# EAGLE design Jalebi_Bai0.1 (EAGLE 7.5.0)
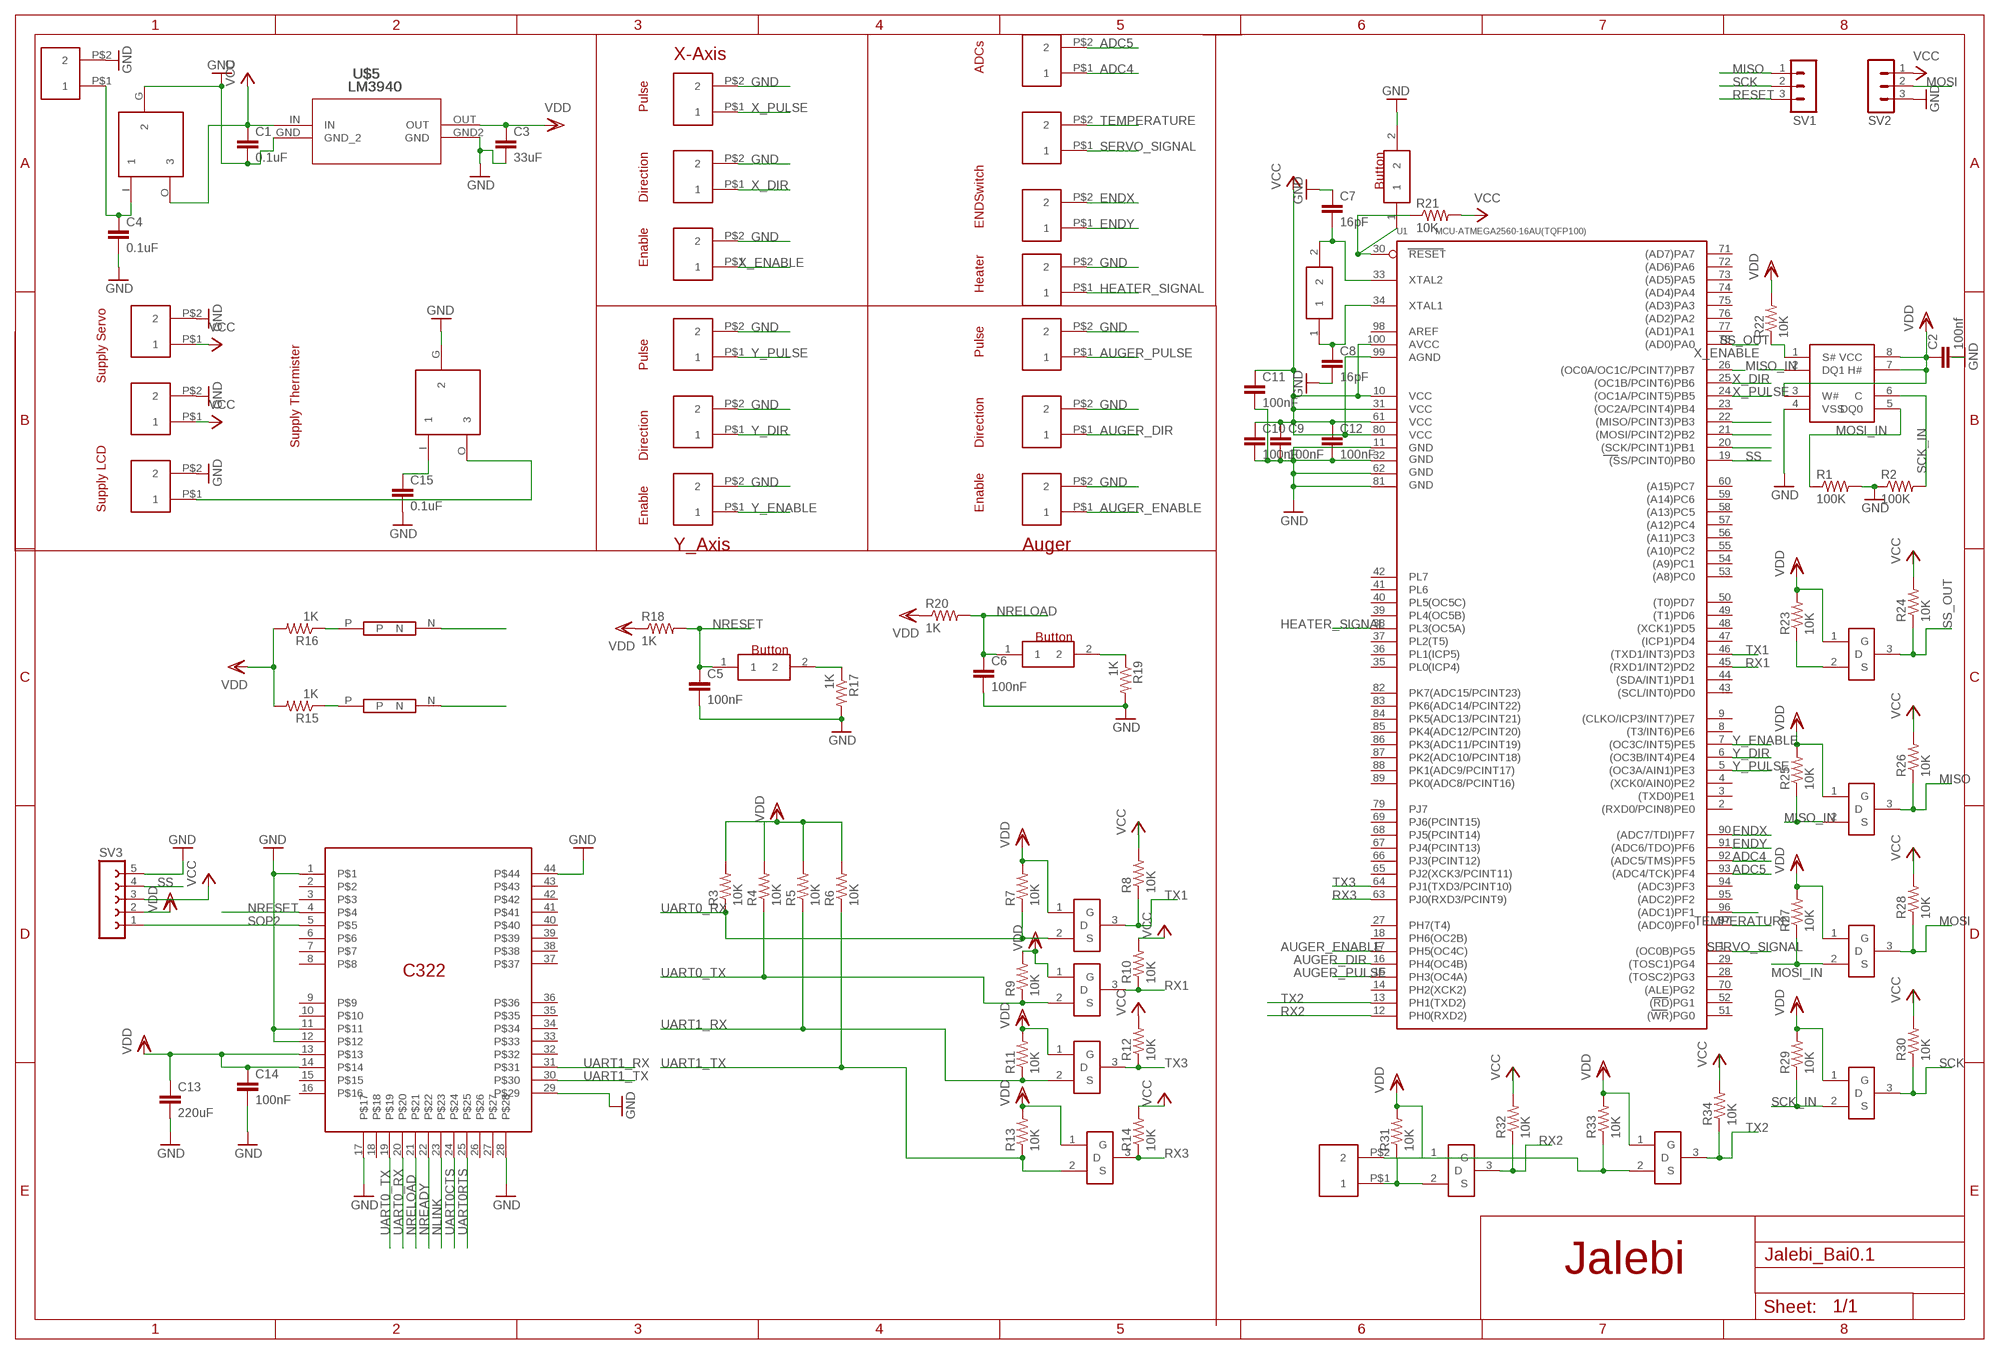
[diagram p0: schematic, sheet 1]

## Parts
C1  0.1uF  C-EUC0805  [C0805]
C2  100nf  C-EUC0805  [C0805]
C3  33uF  C-EUC0805  [C0805]
C4  0.1uF  C-EUC0805  [C0805]
C5  100nF  C-EUC0805  [C0805]
C6  100nF  C-EUC0805  [C0805]
C7  16pF  C-EUC0805  [C0805]
C8  16pF  C-EUC0805  [C0805]
C9  100nF  C-EUC0805  [C0805]
C10  100nF  C-EUC0805  [C0805]
C11  100nF  C-EUC0805  [C0805]
C12  100nF  C-EUC0805  [C0805]
C13  220uF  C-EUC0805  [C0805]
C14  100nF  C-EUC0805  [C0805]
C15  0.1uF  C-EUC0805  [C0805]
R1  100K  R-US_R0805  [R0805]
R2  100K  R-US_R0805  [R0805]
R3  10K  R-US_R0805  [R0805]
R4  10K  R-US_R0805  [R0805]
R5  10K  R-US_R0805  [R0805]
R6  10K  R-US_R0805  [R0805]
R7  10K  R-US_R0805  [R0805]
R8  10K  R-US_R0805  [R0805]
R9  10K  R-US_R0805  [R0805]
R10  10K  R-US_R0805  [R0805]
R11  10K  R-US_R0805  [R0805]
R12  10K  R-US_R0805  [R0805]
R13  10K  R-US_R0805  [R0805]
R14  10K  R-US_R0805  [R0805]
R15  1K  R-US_R0805  [R0805]
R16  1K  R-US_R0805  [R0805]
R17  1K  R-US_R0805  [R0805]
R18  1K  R-US_R0805  [R0805]
R19  1K  R-US_R0805  [R0805]
R20  1K  R-US_R0805  [R0805]
R21  10K  R-US_R0805  [R0805]
R22  10K  R-US_R0805  [R0805]
R23  10K  R-US_R0805  [R0805]
R24  10K  R-US_R0805  [R0805]
R25  10K  R-US_R0805  [R0805]
R26  10K  R-US_R0805  [R0805]
R27  10K  R-US_R0805  [R0805]
R28  10K  R-US_R0805  [R0805]
R29  10K  R-US_R0805  [R0805]
R30  10K  R-US_R0805  [R0805]
R31  10K  R-US_R0805  [R0805]
R32  10K  R-US_R0805  [R0805]
R33  10K  R-US_R0805  [R0805]
R34  10K  R-US_R0805  [R0805]
SUPPLY_LCD  TERMINALBLOCK2PIN  [TERMINALBLOCK2]
SUPPLY_SERVO  TERMINALBLOCK2PIN  [TERMINALBLOCK2]
SUPPLY_THERMISTER  TERMINALBLOCK2PIN  [TERMINALBLOCK2]
SV1  MA03-1  [MA03-1]
SV2  MA03-1  [MA03-1]
SV3  FE05-1  [FE05-1]
U1  MCU-ATMEGA2560-16AU(TQFP100)  [TQFP100-0.5-14X14MM]
U$1  C322STD  [C322]
U$2  7805  [7805]
U$3  TERMINALBLOCK2PIN  [TERMINALBLOCK2]
U$4  FLASHM25PX80  [SO08]
U$5  LM3940  [MP04A]
U$6  BSS138  [SOT23]
U$7  BSS138  [SOT23]
U$8  BSS138  [SOT23]
U$9  BSS138  [SOT23]
U$10  LED(805)  [LED(805)]
U$11  LED(805)  [LED(805)]
U$12  BUTTON  [BUTTON]
U$13  BUTTON  [BUTTON]
U$14  TERMINALBLOCK2PIN  [TERMINALBLOCK2]
U$15  CRYSTAL  [CRYSTAL]
U$16  BUTTON  [BUTTON]
U$17  BSS138  [SOT23]
U$18  BSS138  [SOT23]
U$19  BSS138  [SOT23]
U$20  BSS138  [SOT23]
U$21  BSS138  [SOT23]
U$22  BSS138  [SOT23]
U$23  TERMINALBLOCK2PIN  [TERMINALBLOCK2]
U$24  TERMINALBLOCK2PIN  [TERMINALBLOCK2]
U$25  7805  [7805]
U$26  TERMINALBLOCK2PIN  [TERMINALBLOCK2]
U$27  TERMINALBLOCK2PIN  [TERMINALBLOCK2]
U$28  TERMINALBLOCK2PIN  [TERMINALBLOCK2]
U$29  TERMINALBLOCK2PIN  [TERMINALBLOCK2]
U$30  TERMINALBLOCK2PIN  [TERMINALBLOCK2]
U$31  TERMINALBLOCK2PIN  [TERMINALBLOCK2]
U$32  TERMINALBLOCK2PIN  [TERMINALBLOCK2]
U$34  TERMINALBLOCK2PIN  [TERMINALBLOCK2]
U$35  TERMINALBLOCK2PIN  [TERMINALBLOCK2]
U$36  TERMINALBLOCK2PIN  [TERMINALBLOCK2]
U$37  TERMINALBLOCK2PIN  [TERMINALBLOCK2]

## Nets
ADC4: U1.92((ADC5/TMS)PF5) U$24.P$1
ADC5: U1.93((ADC4/TCK)PF4) U$24.P$2
AUGER_DIR: U1.16(PH4(OC4B)) U$36.P$1
AUGER_ENABLE: U1.17(PH5(OC4C)) U$37.P$1
AUGER_PULSE: U1.15(PH3(OC4A)) U$35.P$1
ENDX: U1.90((ADC7/TDI)PF7) U$23.P$2
ENDY: U1.91((ADC6/TDO)PF6) U$23.P$1
GND: C1.2 C2.2 C3.2 C4.2 C5.2 C6.2 C7.1 C8.2 C9.2 C10.2 C11.2 C12.2 C13.2 C14.2 C15.2 R1.2 R2.1 R17.2 R19.2 SUPPLY_LCD.P$2 SUPPLY_SERVO.P$2 SUPPLY_THERMISTER.P$2 SV2.3 SV3.5 U1.11(GND) U1.32(GND1) U1.62(GND2) U1.81(GND3) U$1.1 U$1.11 U$1.12 U$1.17 U$1.28 U$1.29 U$1.44 U$2.G U$3.P$2 U$4.4(VSS) U$5.GND2(GND) U$5.GND(GND_2) U$16.2 U$25.G U$26.P$2 U$27.P$2 U$28.P$2 U$29.P$2 U$30.P$2 U$31.P$2 U$34.P$2 U$35.P$2 U$36.P$2 U$37.P$2
HEATER_SIGNAL: U1.38(PL3(OC5A)) U$34.P$1
MISO: R26.1 SV1.1 U1.22((MISO/PCINT3)PB3) U$18.3(D)
MISO_IN: R25.1 U$4.2(DQ1) U$18.2(S)
MOSI: R28.1 SV2.2 U1.21((MOSI/PCINT2)PB2) U$19.3(D)
MOSI_IN: R1.1 R27.1 U$4.5(DQ0) U$19.2(S)
N$1: U1.96((ADC1)PF1)
N$3: SUPPLY_LCD.P$1 U$25.O
N$5: C4.1 C15.1 U$2.I U$3.P$1 U$25.I
N$9: R15.1 U$11.P
N$10: C7.2 U1.33(XTAL2) U$15.2
N$11: R16.1 U$10.P
N$12: C8.1 U1.34(XTAL1) U$15.1
N$15: R17.1 U$12.2
N$17: R19.1 U$13.2
NLINK: U$1.23 U$10.N
NREADY: U$1.22 U$11.N
NRELOAD: C6.1 R20.2 U$1.21 U$13.1
NRESET: C5.1 R18.2 U$1.4 U$12.1
RESET: R21.1 SV1.3 U1.30(RESET) U$16.1
RX1: R10.1 U1.45((RXD1/INT2)PD2) U$7.3(D)
RX2: R32.1 U1.12(PH0(RXD2)) U$21.3(D)
RX3: R14.1 U1.63(PJ0(RXD3/PCINT9)) U$9.3(D)
RX_IN: R31.1 U$14.P$1 U$21.2(S)
SCK: R30.1 SV1.2 U1.20((SCK/PCINT1)PB1) U$20.3(D)
SCK_IN: R2.2 R29.1 U$4.6(C) U$20.2(S)
SERVO_SIGNAL: U1.1((OC0B)PG5) U$32.P$1
SOP2: SV3.1 U$1.5
SS: SV3.4 U1.19((SS/PCINT0)PB0)
SS_IN: R22.1 R23.1 U$4.1(S#) U$17.2(S)
SS_OUT: R24.1 U1.78((AD0)PA0) U$17.3(D)
TEMPERATURE: U1.97((ADC0)PF0) U$32.P$2
TX1: R8.1 U1.46((TXD1/INT3)PD3) U$6.3(D)
TX2: R34.1 U1.13(PH1(TXD2)) U$22.3(D)
TX3: R12.1 U1.64(PJ1(TXD3/PCINT10)) U$8.3(D)
TX_IN: R33.1 U$14.P$2 U$22.2(S)
UART0_RX: R3.1 R7.1 U$1.20 U$6.2(S)
UART0_TX: R4.1 R9.1 U$1.19 U$7.2(S)
UART0CTS: U$1.24
UART0RTS: U$1.25
UART1_RX: R5.1 R11.1 U$1.31 U$8.2(S)
UART1_TX: R6.1 R13.1 U$1.30 U$9.2(S)
VCC: C1.1 C9.1 C10.1 C11.1 C12.1 R8.2 R10.2 R12.2 R14.2 R21.2 R24.2 R26.2 R28.2 R30.2 R32.2 R34.2 SUPPLY_SERVO.P$1 SUPPLY_THERMISTER.P$1 SV2.1 SV3.3 U1.10(VCC) U1.31(VCC1) U1.61(VCC2) U1.80(VCC3) U1.99(AGND) U1.100(AVCC) U$2.O U$5.IN
VDD: C2.1 C3.1 C13.1 C14.1 R3.2 R4.2 R5.2 R6.2 R7.2 R9.2 R11.2 R13.2 R15.2 R16.2 R18.1 R20.1 R22.2 R23.2 R25.2 R27.2 R29.2 R31.2 R33.2 SV3.2 U$1.13 U$1.14 U$4.3(W#) U$4.7(H#) U$4.8(VCC) U$5.OUT U$6.1(G) U$7.1(G) U$8.1(G) U$9.1(G) U$17.1(G) U$18.1(G) U$19.1(G) U$20.1(G) U$21.1(G) U$22.1(G)
X_DIR: U1.25((OC1B/PCINT6)PB6) U$27.P$1
X_ENABLE: U1.26((OC0A/OC1C/PCINT7)PB7) U$28.P$1
X_PULSE: U1.24((OC1A/PCINT5)PB5) U$26.P$1
Y_DIR: U1.6((OC3B/INT4)PE4) U$30.P$1
Y_ENABLE: U1.7((OC3C/INT5)PE5) U$31.P$1
Y_PULSE: U1.5((OC3A/AIN1)PE3) U$29.P$1
Unconnected: U1.2((RXD0/PCIN8)PE0) U1.3((TXD0)PE1) U1.4((XCK0/AIN0)PE2) U1.8((T3/INT6)PE6) U1.9((CLKO/ICP3/INT7)PE7) U1.14(PH2(XCK2)) U1.18(PH6(OC2B)) U1.23((OC2A/PCINT4)PB4) U1.27(PH7(T4)) U1.28((TOSC2)PG3) U1.29((TOSC1)PG4) U1.35(PL0(ICP4)) U1.36(PL1(ICP5)) U1.37(PL2(T5)) U1.39(PL4(OC5B)) U1.40(PL5(OC5C)) U1.41(PL6) U1.42(PL7) U1.43((SCL/INT0)PD0) U1.44((SDA/INT1)PD1) U1.47((ICP1)PD4) U1.48((XCK1)PD5) U1.49((T1)PD6) U1.50((T0)PD7) U1.51((WR)PG0) U1.52((RD)PG1) U1.53((A8)PC0) U1.54((A9)PC1) U1.55((A10)PC2) U1.56((A11)PC3) U1.57((A12)PC4) U1.58((A13)PC5) U1.59((A14)PC6) U1.60((A15)PC7) U1.65(PJ2(XCK3/PCINT11)) U1.66(PJ3(PCINT12)) U1.67(PJ4(PCINT13)) U1.68(PJ5(PCINT14)) U1.69(PJ6(PCINT15)) U1.70((ALE)PG2) U1.71((AD7)PA7) U1.72((AD6)PA6) U1.73((AD5)PA5) U1.74((AD4)PA4) U1.75((AD3)PA3) U1.76((AD2)PA2) U1.77((AD1)PA1) U1.79(PJ7) U1.82(PK7(ADC15/PCINT23)) U1.83(PK6(ADC14/PCINT22)) U1.84(PK5(ADC13/PCINT21)) U1.85(PK4(ADC12/PCINT20)) U1.86(PK3(ADC11/PCINT19)) U1.87(PK2(ADC10/PCINT18)) U1.88(PK1(ADC9/PCINT17)) U1.89(PK0(ADC8/PCINT16)) U1.94((ADC3)PF3) U1.95((ADC2)PF2) U1.98(AREF) U$1.2 U$1.3 U$1.6 U$1.7 U$1.8 U$1.9 U$1.10 U$1.15 U$1.16 U$1.18 U$1.26 U$1.27 U$1.32 U$1.33 U$1.34 U$1.35 U$1.36 U$1.37 U$1.38 U$1.39 U$1.40 U$1.41 U$1.42 U$1.43

## Notes on the sheet
- X-Axis
- ADCs
- Pulse
- Direction
- ENDSwitch
- Enable
- Heater
- Pulse
- Pulse
- Supply Servo
- Supply Thermister | Direction
- Direction
- Supply LCD | Enable
- Enable
- Y_Axis | Auger
- Jalebi

## Library data of the parts
C1-C15 = resistor:C-EU: CAPACITOR, European symbol
R1-R34 = resistor:R-US_: RESISTOR, American symbol
SUPPLY_LCD SUPPLY_SERVO SUPPLY_THERMISTER U$3 U$14 U$23 U$24 U$26-U$32 U$34-U$37 = utilities:TERMINALBLOCK
SV1 SV2 = con-lstb:MA03-1: PIN HEADER; OC_FARNELL: unknown; OC_NEWARK: unknown
SV3 = con-lsta:FE05-1: FEMALE HEADER; OC_FARNELL: unknown; OC_NEWARK: unknown
U1 = MCU-ATMEGA2560-16AU_TQFP100_:MCU-ATMEGA2560-16AU(TQFP100): 310010006; AVAILABILITY: Good; DESCRIPTION: ATmega Series 16 MHz 256 KB Flash 8 KB SRAM 8-Bit Microcontroller - TQFP-100; MF: Atmel; MP: ATMEGA2560-16AU; PACKAGE: TQFP-100 Atmel; PRICE: 12.51 USD
U$1 = utilities:C322
U$2 U$25 = utilities:7805
U$4 = Components:FLASHM25PX80
U$5 = Components:LM3940
U$6-U$9 U$17-U$22 = utilities:BSS138
U$10 U$11 = Tarun:LED(805)
U$12 U$13 U$16 = Tarun:BUTTON
U$15 = Tarun:CRYSTAL

## Board
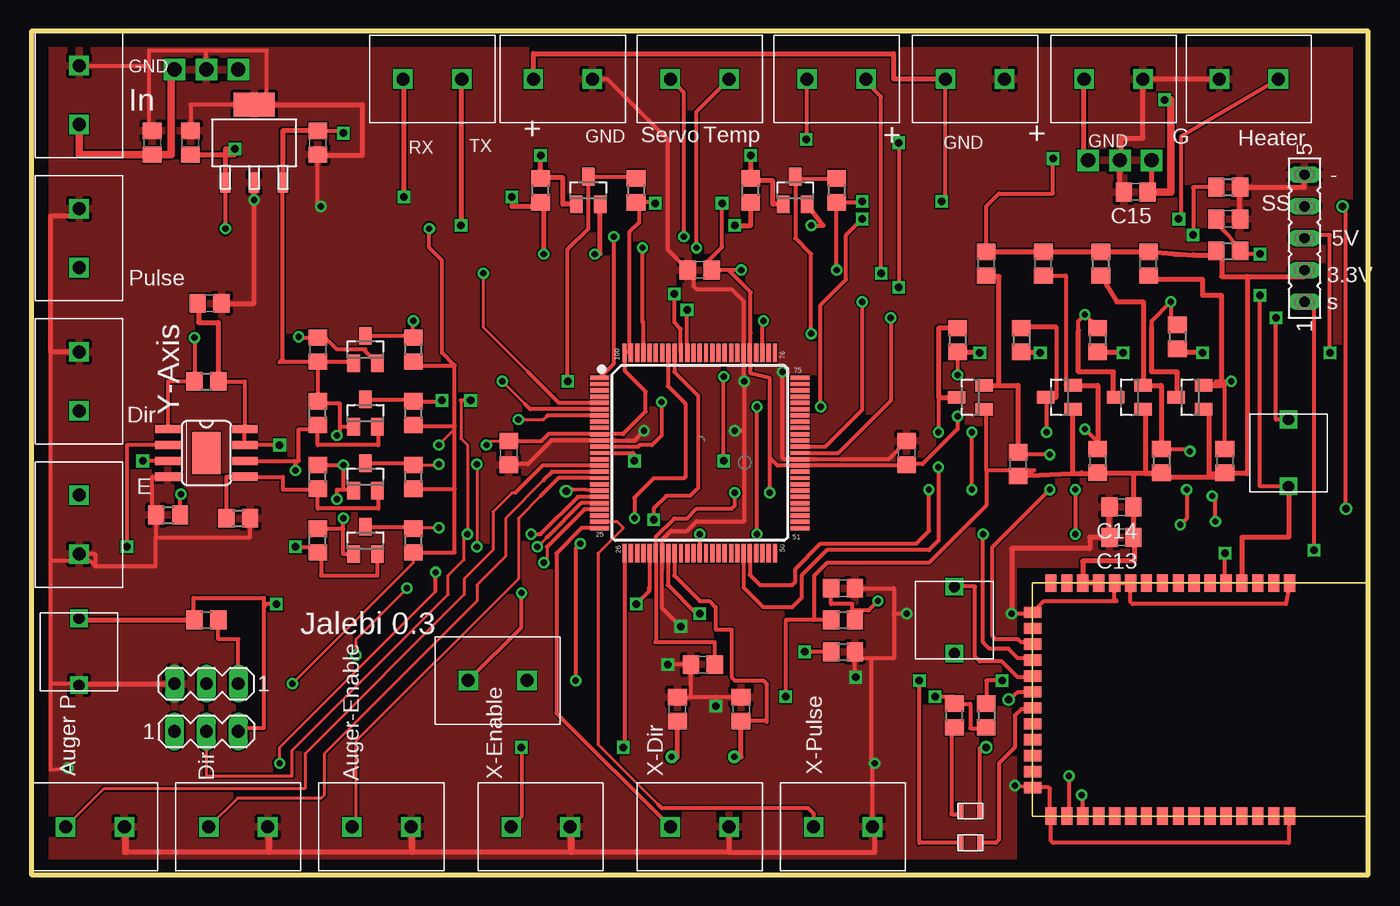
[diagram p1: board, top side]
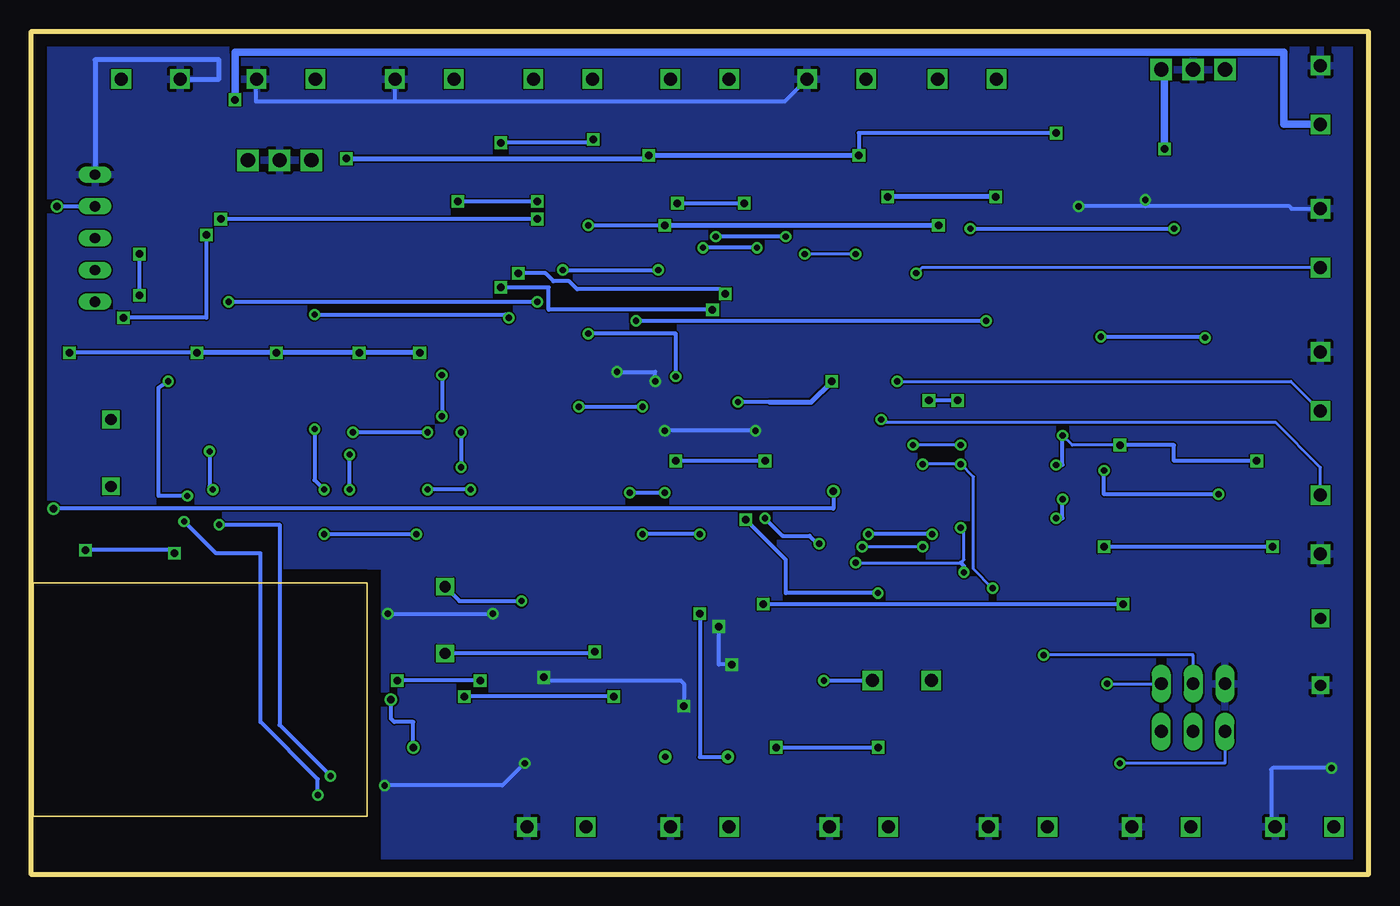
[diagram p2: board, bottom side, seen from below]

Size 106.68 x 67.31 mm. Coordinates in mm from the lower left corner, seen from the top.
Outline: 0,0 106.68,0 106.68,67.31 0,67.31 0,0
Copper layers (1*16): Top 0.035mm / dielectric 1.5mm / Bottom 0.035mm
Design rules "default *": minimum track width 10mil, minimum drill 10mil, track to track 5mil, track to pad 5mil, pad to pad 5mil, via to via 5mil, smd to smd 0mil, copper to edge 40mil, drill to drill 8mil, minimum pad ring 10mil, minimum via ring 8mil, stop-mask expansion 4mil, vias tented up to drill 0mil, thermal gap 10mil

### Footprints (pad centres in the part's own frame; a part is rotated, then mirrored left to right if it is on the bottom)
C0805 = smd 1.3 x 1.5: 1 -0.95,0; 2 0.95,0
R0805 = smd 1.3 x 1.5: 1 -0.95,0; 2 0.95,0
TERMINALBLOCK2 = drill 1.041 square: P$1 -2.35,0; P$2 2.35,0
MA03-1 = drill 1.016 long: 1 -2.54,0; 2 0,0; 3 2.54,0
FE05-1 = drill 0.813 long: 1 -5.08,0; 2 -2.54,0; 3 0,0; 4 2.54,0; 5 5.08,0
TQFP100-0.5-14X14MM = smd 1.5 x 0.35: 1 -8,6; 2 -8,5.5; 3 -8,5; 4 -8,4.5; 5 -8,4; 6 -8,3.5; 7 -8,3; 8 -8,2.5; 9 -8,2; 10 -8,1.5; 11 -8,1; 12 -8,0.5; 13 -8,0; 14 -8,-0.5; 15 -8,-1; 16 -8,-1.5; 17 -8,-2; 18 -8,-2.5; 19 -8,-3; 20 -8,-3.5; 21 -8,-4; 22 -8,-4.5; 23 -8,-5; 24 -8,-5.5; 25 -8,-6; 51 8,-6; 52 8,-5.5; 53 8,-5; 54 8,-4.5; 55 8,-4; 56 8,-3.5; 57 8,-3; 58 8,-2.5; 59 8,-2; 60 8,-1.5; 61 8,-1; 62 8,-0.5; 63 8,0; 64 8,0.5; 65 8,1; 66 8,1.5; 67 8,2; 68 8,2.5; 69 8,3; 70 8,3.5; 71 8,4; 72 8,4.5; 73 8,5; 74 8,5.5; 75 8,6 | smd 0.35 x 1.5: 26 -6,-8; 27 -5.5,-8; 28 -5,-8; 29 -4.5,-8; 30 -4,-8; 31 -3.5,-8; 32 -3,-8; 33 -2.5,-8; 34 -2,-8; 35 -1.5,-8; 36 -1,-8; 37 -0.5,-8; 38 0,-8; 39 0.5,-8; 40 1,-8; 41 1.5,-8; 42 2,-8; 43 2.5,-8; 44 3,-8; 45 3.5,-8; 46 4,-8; 47 4.5,-8; 48 5,-8; 49 5.5,-8; 50 6,-8; 76 6,8; 77 5.5,8; 78 5,8; 79 4.5,8; 80 4,8; 81 3.5,8; 82 3,8; 83 2.5,8; 84 2,8; 85 1.5,8; 86 1,8; 87 0.5,8; 88 0,8; 89 -0.5,8; 90 -1,8; 91 -1.5,8; 92 -2,8; 93 -2.5,8; 94 -3,8; 95 -3.5,8; 96 -4,8; 97 -4.5,8; 98 -5,8; 99 -5.5,8; 100 -6,8
C322 = smd 1.4 x 0.9: 1 -5.5,7.195; 2 -5.5,5.925; 3 -5.5,4.655; 4 -5.5,3.385; 5 -5.5,2.115; 6 -5.5,0.845; 7 -5.5,-0.425; 8 -5.5,-1.695; 9 -5.5,-2.965; 10 -5.5,-4.235; 11 -5.5,-5.505; 12 -5.5,-6.775; 13 -5.5,-8.045; 14 -5.5,-9.315; 15 -5.5,-10.585; 16 -5.5,-11.855; 29 13.12,-11.855; 30 13.12,-10.585; 31 13.12,-9.315; 32 13.12,-8.045; 33 13.12,-6.775; 34 13.12,-5.505; 35 13.12,-4.235; 36 13.12,-2.965; 37 13.12,-1.695; 38 13.12,-0.425; 39 13.12,0.845; 40 13.12,2.115; 41 13.12,3.385; 42 13.12,4.655; 43 13.12,5.925; 44 13.12,7.195 | smd 0.9 x 1.4: 17 -3.15,-13.325; 18 -1.88,-13.325; 19 -0.61,-13.325; 20 0.66,-13.325; 21 1.93,-13.325; 22 3.2,-13.325; 23 4.47,-13.325; 24 5.74,-13.325; 25 7.01,-13.325; 26 8.28,-13.325; 27 9.55,-13.325; 28 10.82,-13.325
7805 = drill 1.143 square: G 0,0; I 0,-2.54; O 0,2.54
SO08 = smd 0.66 x 2.032: 1 -1.905,-3.073; 2 -0.635,-3.073; 3 0.635,-3.073; 4 1.905,-3.073; 5 1.905,3.073; 6 0.635,3.073; 7 -0.635,3.073; 8 -1.905,3.073 | smd 3.327 x 2.286: P$1 0,0
MP04A = smd 3.302 x 1.905: GND 0,3.048 | smd 0.838 x 1.6: GND2 0,-3.2; IN -2.3,-3.2; OUT 2.3,-3.2
SOT23 = smd 1 x 1.4: 1 -0.95,-1.1; 2 0.95,-1.1; 3 0,1.1
LED(805) = smd 0.45 x 1.25: N 0.775,0; P -0.775,0
BUTTON = drill 0.9 square: 1 -2.667,0; 2 2.667,0
CRYSTAL = drill 0.5: 1 -2.5,0; 2 2.5,0

### Placement (x,y rotation side)
C1  12.7,58.42 90 top
C2  14.22,45.59 0 top
C3  22.86,58.42 270 top
C4  9.65,58.42 90 top
C5  95.5,52.32 0 top
C6  64.77,22.86 0 top
C7  51.56,13.21 270 top
C8  56.64,13.21 90 top
C9  53.59,16.76 180 top
C10  69.85,33.66 90 top
C11  53.34,48.26 180 top
C12  38.1,33.66 270 top
C13  87,26.92 180 top
C14  87,29.34 180 top
C15  88.14,54.48 180 top
R1  16.51,28.45 0 top
R2  10.92,28.7 0 top
R3  80.77,48.77 90 top
R4  76.2,48.77 90 top
R5  89.15,48.77 90 top
R6  85.34,48.77 90 top
R7  85.09,33.02 270 top
R8  78.99,42.67 270 top
R9  78.74,32.77 270 top
R10  73.91,42.67 270 top
R11  95.25,33.02 270 top
R12  91.44,42.93 270 top
R13  90.17,33.02 270 top
R14  85.09,42.67 270 top
R15  73.66,12.7 90 top
R16  76.2,12.7 270 top
R17  95.5,54.86 0 top
R18  95.5,49.78 0 top
R19  64.77,17.78 0 top
R20  64.77,20.32 0 top
R21  13.97,20.32 0 top
R22  13.97,39.37 0 top
R23  22.86,41.91 270 top
R24  30.48,41.91 270 top
R25  22.86,26.67 90 top
R26  30.48,26.67 270 top
R27  22.86,31.75 90 top
R28  30.48,31.75 270 top
R29  22.86,36.83 90 top
R30  30.48,36.83 270 top
R31  40.64,54.61 90 top
R32  48.26,54.61 270 top
R33  57.4,54.61 90 top
R34  64.26,54.61 270 top
SUPPLY_LCD  86.36,63.5 0 top
SUPPLY_SERVO  75.31,63.5 0 top
SUPPLY_THERMISTER  42.42,63.5 0 top
SV1  13.97,11.43 0 top
SV2  13.97,15.24 180 top
SV3  101.6,50.8 90 top
U1  53.34,33.66 0 top
U$1  93.22,17.78 270 top
U$2  13.97,64.26 270 top
U$3  3.81,62.23 90 top
U$4  13.97,33.66 270 top
U$5  17.78,58.42 0 top
U$6  82.04,38.1 90 top
U$7  74.93,38.1 90 top
U$8  92.46,38.1 90 top
U$9  87.63,38.1 90 top
U$10  74.93,2.54 0 top
U$11  74.93,5.08 0 top
U$12  100.33,33.66 90 top
U$13  73.66,20.32 270 top
U$14  32,63.5 0 top
U$15  53.59,9.4 180 top
U$16  3.81,17.78 270 top
U$17  26.67,41.91 0 top
U$18  26.67,26.67 0 top
U$19  26.67,31.75 0 top
U$20  26.67,36.83 0 top
U$21  44.45,54.61 0 top
U$22  60.96,54.61 0 top
U$23  64.26,63.5 180 top
U$24  37.21,15.49 0 top
U$25  86.87,57.02 90 top
U$26  64.77,3.81 0 top
U$27  53.34,3.81 0 top
U$28  40.64,3.81 0 top
U$29  3.81,50.8 90 top
U$30  3.81,39.37 90 top
U$31  3.81,27.94 270 top
U$32  53.34,63.5 0 top
U$34  97.16,63.5 180 top
U$35  5.08,3.81 0 top
U$36  16.51,3.81 0 top
U$37  27.94,3.81 0 top

### Tracks (layer width: path | path; a pad name or v marks a point on that pad's centre or on a via)
ADC4  (via drill 0.5, 0.6)
  Top 0.305: U1.92 51.31,41.66 51.31,40.13 53.21,38.23 53.21,30.86 52.58,30.23 50.67,30.23 49.66,29.21 v49.66,28.32 | U$24.P$1 39.12,19.75 v39.12,22.48
  Bottom 0.305: v49.66,28.32 46.48,25.15 46.48,22.48 v39.12,22.48
ADC5  (via drill 0.5)
  Top 0.305: U1.93 50.8,41.66 50.8,38.99 52.2,37.59 52.2,31.75 52.07,31.62 49.66,31.62 48.13,30.1 v48.13,28.45 | v43.81,26.42 43.43,26.04 v43.43,15.49
  Bottom 0.305: v48.13,28.45 46.74,27.05 44.58,27.05 43.94,26.42 v43.81,26.42 | v43.43,15.49 U$24.P$2
AUGER_DIR
  Top 0.254: 40.89,31.5 37.85,28.45 37.85,25.4 35.56,23.11 35.56,21.84 23.37,9.65 23.37,6.35 23.11,6.1 16.45,6.1 U$36.P$1
  Top 0.305: U1.16 41.55,32.16 40.89,31.5
AUGER_ENABLE
  Top 0.254: 40.64,30.23 38.86,28.45 38.86,23.62 25.91,10.67 25.91,3.81 U$37.P$1
  Top 0.305: U1.17 42.07,31.66 40.64,30.23
AUGER_PULSE
  Top 0.254: 38.61,30.48 38.35,30.48 36.83,28.96 36.83,25.91 34.54,23.62 34.54,22.35 21.84,9.65 21.84,6.86 5.78,6.86 U$35.P$1
  Top 0.305: U1.15 40.78,32.66 38.61,30.48
ENDX  (via drill 0.6)
  Top 0.305: U1.90 52.32,41.66 v52.32,45.09 | U$23.P$2 61.85,63.44 v61.85,58.67 | v69.22,58.42 v69.22,46.86
  Bottom 0.305: v52.32,45.09 65.41,45.09 65.41,46.86 v69.22,46.86 | v61.85,58.67 62.1,58.42 v69.22,58.42
ENDY  (via drill 0.6)
  Top 0.305: U1.91 51.82,41.66 51.82,43.56 51.31,44.07 v51.31,46.35 | v67.82,48.01 67.82,62.1 66.61,63.31 U$23.P$1
  Bottom 0.305: v51.31,46.35 51.69,46.74 63.12,46.74 63.75,47.37 65.02,47.37 65.66,48.01 v67.82,48.01
GND  (via drill 0.5, 0.6)
  Top 0.305: U$26.P$2 67.12,8.7 v67.31,8.89 67.06,8.89 67.06,17.27 | C7.1 52.64,14.16 | 52.64,14.16 C9.2 v50.8,16.76 | 52.64,14.16 C8.2 54.61,14.16 | C6.2 68.83,22.86 68.83,20.83 | 68.83,20.83 68.83,17.27 67.06,17.27 | 67.06,17.27 65.72,17.27 R19.2 65.72,15.75 v65.79,15.75 | 54.61,14.16 54.61,14.22 | 54.61,14.16 v54.61,13.46 | C12.2 38.16,32.77 39.62,32.77 41.51,34.66 U1.11 48.12,34.66 | U$2.G 13.97,65.79 | 13.97,65.79 18.8,65.79 18.8,61.47 U$5.GND 12.7,61.47 C1.2 | U$3.P$2 9.4,64.58 | 9.4,64.58 9.4,65.79 13.97,65.79 | C4.2 9.4,59.37 9.4,64.58 | v78.49,7.11 79.91,6.96 U$1.28 81.18,6.96 81.28,6.86 81.28,4.74 U$1.29 81.36,2.71 81.53,2.54 100.33,2.54 100.33,4.58 U$1.44 | v78.23,20.83 79.79,20.83 U$1.17 80.81,21.84 86.61,21.84 86.44,22.02 U$1.12 86.36,23.36 | v69.85,20.83 68.83,20.83 | U$1.1 100.12,21.59 87.88,21.59 87.71,21.76 U$1.11 86.53,23.28 86.36,23.11 86.36,23.36 | 86.36,23.36 86.36,23.37 | C10.2 68.4,33.16 U1.62 60.06,33.16 59.94,33.27 v59.94,40.13 | SUPPLY_THERMISTER.P$2 45.97,63.5 50.8,58.67 50.8,49.85 C11.2 52.83,47.82 52.83,46.99 53.09,46.74 55.88,46.74 56.84,45.78 U1.81 56.84,39.43 v56.9,39.37 56.9,35.43 | R2.1 9.91,28.7 | U$4.4 9.65,31.75 9.65,28.7 9.91,28.7 | 9.91,28.7 9.91,26.92 | 9.91,26.92 17.46,26.92 R1.2 | 5.08,24.64 5.08,25.59 U$31.P$2 | 5.08,24.64 9.91,24.64 9.91,26.92 | v51.82,19.81 50.29,21.34 50.29,24.39 U1.32 50.34,26.72 51.05,27.43 52.32,27.43 53.09,28.19 56.9,28.19 56.9,35.43 | 4.06,52.58 3.81,52.83 U$29.P$2 | v23.11,53.34 22.86,53.59 C3.2 | U$5.GND2 v17.78,53.85 | 48.12,34.66 arc90 48.26,34.8 | 48.12,34.66 v48.9,35.43 | v56.13,35.43 56.9,35.43 | 1.52,41.72 1.52,25.02 | 1.52,25.02 1.52,15.24
  Top 0.305: 1.52,15.24 1.52,8.38 v2.92,8.51 | 5.08,24.64 4.7,25.02 1.52,25.02 | U$16.2 3.68,15.24 1.52,15.24
  Top 0.406: C5.2 R17.2 101.6,54.86 SV3.5 | U$34.P$2 SUPPLY_LCD.P$2 88.71,58.8 87,58.8 87,57.02 U$25.G 86.87,54.48 C15.2 | 55.69,1.78 67.31,1.78 67.31,3.81 U$26.P$2 | U$27.P$2 55.69,1.78 | 55.69,1.78 43.18,1.78 43.18,3.81 U$28.P$2 42.99,1.78 30.48,1.78 30.48,3.81 U$37.P$2 30.29,1.78 19.05,1.78 19.05,3.81 U$36.P$2 18.86,1.78 7.62,1.78 7.62,3.81 U$35.P$2 7.43,1.78 | U$16.2 3.81,15.24 SV2.3 | 3.81,25.65 U$31.P$2 | 4.06,52.58 1.52,52.58 1.52,41.72 U$30.P$2 | 18.8,61.47 26.42,61.47 26.42,57.4 22.86,57.4 C3.2 | C2.2 17.78,45.59 U$5.GND2 | C14.2 C13.2 84.45,26.92 84.45,26.04 78.23,26.04 v78.23,20.83
  Bottom 0.305: v50.8,16.76 51.82,16.76 v51.82,19.81 | v65.79,15.75 65.79,15.49 54.86,15.49 54.61,15.24 v54.61,13.46 | v67.31,8.89 69.09,7.11 v78.49,7.11 | v78.23,20.83 v69.85,20.83 | 17.78,53.34 6.29,53.34 6.1,53.15 U$29.P$2 | 17.78,53.34 v23.11,53.34 | v17.78,53.85 17.78,53.34 | v59.94,40.13 56.9,40.13 v56.9,39.37 | 77.66,61.72 46.55,61.72 SUPPLY_THERMISTER.P$2 | v48.9,35.43 v56.13,35.43 | 77.66,61.72 SUPPLY_SERVO.P$2 | SUPPLY_LCD.P$2 88.77,63.44 88.77,61.72 77.66,61.72 | v2.92,8.51 7.62,8.51 7.75,8.38 7.75,4.45 7.43,4.13 U$35.P$2
  Bottom 0.406: U$34.P$2 91.69,63.5 91.69,65.02 101.6,65.02 SV3.5
  pour Bottom: 1.27,66.67 105.66,66.67 105.66,24.64 78.49,24.64 78.49,0.76 1.27,0.76
  pour Top: 1.65,66.17 105.66,66.17 105.66,24.77 78.36,24.77 78.36,0.76 1.65,0.76
HEATER_SIGNAL  (via drill 0.5, 0.6)
  Top 0.305: v62.99,37.34 62.99,45.47 65.02,47.5 65.02,51.05 v66.29,52.32 | U$34.P$1 91.76,58.93 91.76,52.32 v91.57,52.32 | U1.38 v53.34,27.18 | v57.91,27.18 v57.91,37.34
  Bottom 0.305: 62.74,37.59 v62.99,37.34 v57.91,37.34 | v53.34,27.18 v57.91,27.18 | v66.29,52.32 v91.57,52.32
MISO  (via drill 0.5)
  Top 0.254: 41.15,26.16 41.15,25.15 v40.89,24.89 | 29.72,27.77 29.8,27.69 v32.51,27.69 32.26,27.43 | v19.81,8.89 19.81,10.16 32.26,22.61
  Top 0.305: U$18.3 29.72,27.77 30.48,27.77 R26.1 | U1.22 44.14,29.16 41.15,26.16 | 32.26,22.61 v32.26,24.13
  Top 0.406: 26.67,27.62 U$18.3
  Bottom 0.254: v40.89,24.89 32.51,24.89 32.26,25.15 32.26,27.43 v32.51,27.69 | SV1.1 11.43,8.89 v19.81,8.89
  Bottom 0.305: v32.26,24.13 32.26,24.64 32.51,24.89
MISO_IN  (via drill 0.6)
  Top 0.305: U$18.2 27.62,23.88 23.11,23.88 23.11,25.72 R25.1 22.86,26.16 v21.08,26.16 | U$4.2 7.62,34.29 v7.62,26.16
  Bottom 0.305: v7.62,26.16 v21.08,26.16
MOSI  (via drill 0.5)
  Top 0.254: R28.1 32.45,32.7 v32.51,32.77 | v35.56,32.77 v35.56,26.16 | v40.39,26.16 41.15,26.92 | v25.91,17.53 25.91,18.8 v29.97,22.86
  Top 0.305: U$19.3 30.48,32.85 R28.1 | U1.21 43.88,29.66 41.15,26.92
  Bottom 0.254: v35.56,32.77 v32.51,32.77 31.5,31.75 31.5,24.38 v29.97,22.86 | v35.56,26.16 v40.39,26.16 | SV2.2 13.97,17.53 v25.91,17.53
MOSI_IN
  Top 0.305: U$19.2 27.69,30.65 27.69,29.21 22.86,29.21 R27.1 22.86,30.73 20.07,30.73 20.07,31.75 U$4.5 15.56,31.75 R1.1
N$3
  Top 0.406: U$25.O 84.01,57.02 SUPPLY_LCD.P$1
N$5  (via drill 0.6)
  Top 0.406: C15.1 89.41,54.48 U$25.I
  Top 0.61: C15.1 90.93,54.48 90.93,61.85 v90.42,61.85 | U$3.P$1 3.81,57.47 C4.1 11.18,57.47 11.18,64.01 U$2.I
  Bottom 0.61: U$3.P$1 6.73,59.88 6.73,65.66 90.42,65.66 v90.42,61.85
N$9
  Top 0.305: R15.1 73.41,11.75 73.41,4.83 74.16,4.83 U$11.P
N$10  (via drill 0.6)
  Top 0.305: U1.33 50.8,25.66 50.8,23.11 53.09,20.83 v53.34,20.83
  Top 0.406: U$15.2 51.56,9.4 C7.2
  Bottom 0.305: v53.34,20.83 53.34,9.4 U$15.2
N$11  (via drill 0.6)
  Top 0.305: U$10.P 70.87,2.54 v70.87,15.49 | v77.47,15.49 76.2,15.49 R16.1
  Bottom 0.305: v70.87,15.49 v77.47,15.49
N$12
  Top 0.305: U1.34 51.31,25.66 51.31,23.88 53.34,21.84 54.1,21.84 54.61,21.34 54.61,19.56 55.88,19.56 55.88,15.75 56.13,15.49 58.42,15.49 58.67,15.24 58.67,12.19 58.61,12.26 C8.1 56.64,12.19
  Top 0.406: U$15.1 56.64,9.4 C8.1
N$15  (via drill 0.6)
  Top 0.305: U$12.2 99.31,36.32 v99.31,44.45 | R17.1 92.71,54.86 v92.71,51.05
  Bottom 0.305: v92.71,51.05 92.71,44.45 v99.31,44.45
N$17  (via drill 0.6)
  Top 0.305: R19.1 v61.72,17.78
  Bottom 0.305: v61.72,17.78 61.85,17.65 U$13.2
NLINK
  Top 0.305: U$1.23 79.79,13.21 78.99,13.21 78.49,12.7 78.49,10.16 77.22,8.89 77.22,2.79 76.96,2.54 U$10.N
NREADY  (via drill 0.6)
  Top 0.305: U$11.N 75.7,10.16 v76.2,10.16 | v77.98,13.97 78.74,14.58 U$1.22
  Bottom 0.305: v76.2,10.16 76.2,12.19 77.72,12.19 77.98,12.45 v77.98,13.97
NRELOAD  (via drill 0.5)
  Top 0.305: R20.2 65.53,20.32 65.53,21.08 | 65.53,21.08 65.53,21.59 63.82,21.59 C6.1 | U$1.21 79.79,15.75 78.74,15.75 77.47,17.02 75.69,17.02 75.31,17.4 75.31,22.99 U$13.1 | v67.56,21.84 66.8,21.08 65.53,21.08
  Bottom 0.305: U$13.1 72.52,21.84 v67.56,21.84
NRESET  (via drill 0.6)
  Top 0.305: C5.1 94.55,52 95.5,51.05 R18.2 96.45,49.53 v98.04,49.53 | U$12.1 98.04,30.99 v98.04,46.23
  Top 0.406: U$12.1 100.33,26.92 96.6,26.92 U$1.4
  Bottom 0.305: v98.04,46.23 v98.04,49.53
RESET  (via drill 0.6)
  Top 0.305: U1.30 49.34,22.86 49.28,22.86 49.28,22.61 v48.26,21.59 | R21.1 12.95,20.32 12.95,22.1 18.54,22.1 18.54,21.34 | 18.54,21.34 18.54,11.68 16.51,11.68 SV1.3 | v19.56,21.59 18.8,21.59 18.54,21.34
  Top 0.406: U$16.1 3.56,20.45 3.56,20.32 R21.1
  Bottom 0.305: v48.26,21.59 v19.56,21.59
RX1  (via drill 0.5)
  Top 0.305: U1.45 56.84,22.92 58.42,21.34 60.71,21.34 61.47,22.1 61.47,23.88 63.5,25.91 71.63,25.91 72.39,26.67 v72.39,32.51 | 72.39,38.1 v72.39,35.31
  Top 0.406: R10.1 72.39,43.62 72.39,38.1 U$7.3
  Bottom 0.305: v72.39,35.31 v72.39,32.51
RX2  (via drill 0.5, 0.6)
  Top 0.305: R32.1 48.26,55.71 U$21.3 44.45,51.56 42.8,49.91 v42.8,39.37 | U1.12 48.38,34.16 arc90 48.51,34.29 49.53,34.29 50.29,35.05 v50.29,37.72
  Bottom 0.305: 47.75,37.72 v50.29,37.72
  Bottom 0.406: 47.75,37.72 44.45,37.72 v42.8,39.37
RX3  (via drill 0.5)
  Top 0.305: U1.63 64.39,33.66 68.58,37.85 v68.58,44.45 | 83.57,43.43 83.57,44.2 v84.07,44.7 85.09,43.69 R14.1
  Top 0.406: U$9.3 86.36,38.1 86.36,40.13 83.57,40.13 83.57,43.43 | 85.09,43.43 R14.1
  Bottom 0.305: v84.07,44.7 68.83,44.7 v68.58,44.45
RX_IN  (via drill 0.5, 0.6)
  Top 0.254: v44.96,49.53 45.4,49.53
  Top 0.406: U$14.P$1 29.72,63.5 v29.72,54.1 | v38.35,54.1 38.35,53.34 40.64,53.34 R31.1 40.89,53.66 v40.89,49.53 | 45.4,49.53 U$21.2
  Bottom 0.254: v40.89,49.53 v44.96,49.53
  Bottom 0.406: v29.72,54.1 v38.35,54.1
SCK  (via drill 0.5, 0.6)
  Top 0.254: SV1.2 13.97,7.87 20.83,7.87 20.83,9.91 33.27,22.35 33.27,23.88 34.54,25.15 34.54,26.92 v34.8,27.18 34.8,34.29 34.29,34.8 34.29,37.85
  Top 0.305: U$20.3 30.48,37.93 R30.1 32.7,37.78 v32.77,37.85 | U1.20 43.62,30.16 40.64,27.18 v39.88,27.18 | v35.05,37.85 34.29,37.85
  Bottom 0.305: v32.77,37.85 v35.05,37.85 | v34.8,27.18 v39.88,27.18
SCK_IN  (via drill 0.5)
  Top 0.305: U$20.2 27.69,35.73 27.69,34.29 22.86,34.29 R29.1 22.86,35.56 21.34,35.56 21.34,33.02 20.95,33.02 | U$4.6 20.95,33.02 | R2.2 11.87,30.29 v11.94,30.35 | v21.08,32.26 21.08,32.89 20.95,33.02
  Bottom 0.305: v11.94,30.35 21.08,30.35 v21.08,32.26
SERVO_SIGNAL  (via drill 0.5)
  Top 0.305: U1.1 46.48,40.8 v46.48,50.93 | v52.07,50.93 52.07,62.42 U$32.P$1
  Bottom 0.305: v46.48,50.93 v52.07,50.93
SOP2  (via drill 0.6)
  Top 0.305: U$1.5 95.25,23.36 v95.25,25.65 | v102.36,25.91 102.36,45.47 102.11,45.72 SV3.1
  Bottom 0.305: v95.25,25.65 95.5,25.91 v102.36,25.91
SS  (via drill 0.6)
  Top 0.305: U1.19 43.18,30.73 v42.67,30.61 | v104.9,29.21 104.9,53.34 v104.65,53.34
  Bottom 0.305: v42.67,30.61 42.67,29.21 v104.9,29.21 | v104.65,53.34 SV3.4
SS_IN  (via drill 0.5)
  Top 0.305: v13.02,42.86 R22.1 10.9,39.37 U$4.1 | U$17.2 26.67,41.76 26.67,41.91 24.38,41.91 23.43,42.86 R23.1 21.4,42.86 v21.34,42.93
  Bottom 0.305: v13.02,42.86 13.09,42.93 v21.34,42.93
SS_OUT  (via drill 0.5)
  Top 0.305: U$17.3 30.48,43.01 R24.1 v30.48,44.2 | 58.42,43.94 v58.42,44.2 58.34,44.12 U1.78
  Bottom 0.305: v30.48,44.2 v58.42,44.2
TEMPERATURE  (via drill 0.5)
  Top 0.305: U1.97 48.84,44.12 48.77,44.12 v48.77,50.04 | v53.09,50.04 53.09,60.9 U$32.P$2
  Bottom 0.305: v48.77,50.04 v53.09,50.04
TX1  (via drill 0.5)
  Top 0.305: 81.79,43.69 81.79,38.1 | U1.46 57.34,23.94 58.17,23.11 60.71,23.11 60.96,23.37 60.96,24.38 62.99,26.42 70.61,26.42 71.63,27.43 v71.63,30.73 | v75.06,30.73 v75.06,35.31 | v81.03,35.31 81.03,38.02 U$6.3
  Top 0.406: U$6.3 81.79,38.1 | 81.79,43.69 78.99,43.69 R8.1
  Bottom 0.305: v71.63,30.73 v75.06,30.73 | v75.06,35.31 v81.03,35.31
TX2  (via drill 0.5, 0.6)
  Top 0.305: R34.1 61.11,55.56 U$22.3 60.96,50.8 62.23,49.53 v62.23,43.18 | v55.24,33.02 v55.24,39.75 | U1.13 48.01,33.66 48.13,33.53 v48.13,33.02
  Bottom 0.305: v55.24,39.75 55.24,43.18 v62.23,43.18 | v48.13,33.02 v55.24,33.02
TX3  (via drill 0.5)
  Top 0.305: U1.64 63.37,34.16 66.29,37.08 v66.29,45.72 | 89.41,43.69 89.41,44.2 v90.93,45.72 90.93,44.38 R12.1
  Top 0.406: U$8.3 91.44,38.1 91.44,40.13 89.41,40.13 89.41,43.69 | 91.44,43.69 R12.1
  Bottom 0.305: v90.93,45.72 v66.29,45.72
TX_IN  (via drill 0.5, 0.6)
  Top 0.305: v62.23,51.82 63.18,51.82
  Top 0.406: R33.1 57.4,51.82 v56.13,51.82 | 63.18,51.82 U$22.2 | U$14.P$2 34.29,63.5 v34.29,51.82
  Bottom 0.305: v56.13,51.82 v62.23,51.82
  Bottom 0.406: v34.29,51.82 v56.13,51.82
UART0_RX  (via drill 0.5)
  Top 0.305: R3.1 82.55,47.82 82.55,39.12 83.14,39.12 U$6.2 | U$1.20 79.74,17.27 78.74,17.27 77.98,18.03 76.45,18.03 75.95,18.54 v75.95,27.18 | R7.1 85.09,34.54 v84.07,35.56 | v83.31,30.73 v83.31,27.18
  Top 0.406: U$6.2 85.09,39.05 R7.1
  Bottom 0.305: v84.07,35.56 84.07,31.5 v83.31,30.73 | v83.31,27.18 v75.95,27.18
UART0_TX  (via drill 0.5)
  Top 0.305: U$1.19 79.74,18.54 78.99,18.54 78.74,18.8 76.96,18.8 76.71,19.05 76.71,26.16 v81.28,30.73 | v81.28,33.53 78.93,33.53 R9.1
  Top 0.406: R9.1 78.74,39.05 U$7.2 77.22,39.05 77.22,47.75 76.2,47.75 R4.1
  Bottom 0.305: v81.28,30.73 v81.28,33.53
UART1_RX  (via drill 0.5)
  Top 0.305: R11.1 95.25,39.05 94.23,39.05 94.55,39.37 v95.76,39.37 | U$1.31 83.9,6.27 v83.82,6.35 | v94.49,28.19 94.49,29.97 v94.23,30.23
  Top 0.406: U$8.2 94.23,39.05 95,39.05 95,46.23 93.47,46.23 93.47,47.5 89.15,47.5 R5.1
  Bottom 0.305: v83.82,6.35 83.82,7.62 88.39,12.19 88.39,25.65 91.95,25.65 v94.49,28.19 | v94.23,30.23 96.52,30.23 96.52,38.86 v95.76,39.37
UART1_TX  (via drill 0.5)
  Top 0.305: R13.1 92.27,33.97 v92.46,33.78 | v92.2,30.73 92.2,28.45 v91.69,27.94 | v82.8,7.87 82.8,4.83 U$1.30
  Top 0.406: R13.1 90.17,39.05 U$9.2 88.73,45.72 86.61,45.72 R6.1
  Bottom 0.305: v92.46,33.78 92.46,30.99 v92.2,30.73 | v91.69,27.94 86.87,27.94 86.87,11.94 v82.8,7.87
VCC  (via drill 0.5, 0.6)
  Top 0.254: R26.2 30.48,24.89 v20.83,15.24 | 33.78,35.81 33.78,35.56 v32.51,34.29 | v36.32,34.29 36.64,34.6 C12.1
  Top 0.305: C9.1 54.54,18.54 49.78,18.54 49.84,18.6 U1.31 49.84,26.98 51.31,28.45 52.32,28.45 53.09,29.21 55.88,29.21 56.13,29.46 v56.13,30.48 | 33.78,30.8 33.78,25.72 R26.2 | 33.78,30.8 33.78,35.81 | 33.78,35.81 33.78,40.64 | 30.8,40.64 30.48,40.64 R24.2 30.8,40.64 | R30.2 30.48,35.81 33.78,35.81 | R28.2 33.78,30.8 | C12.1 40.7,34.6 41.27,35.18 44.73,35.18 | 44.73,35.18 U1.10 47.22,35.16 49.02,36.96 49.02,38.55 47.34,40.23 U1.100 U1.99 47.75,41.74 47.75,51.31 48.51,52.07 48.51,53.41 R32.2 49.72,53.66 v49.78,53.59 | v64.26,48.26 R34.2 65.91,53.66 65.91,53.72 v66.29,53.72 | v103.63,41.66 103.63,51.05 101.6,51.05 SV3.3 | SV2.1 16.51,18.8 14.92,18.8 R21.2 | 55.63,48.26 57.4,46.48 57.4,43.24 U1.80 57.4,40.45 57.4,40.01 58.93,39.62 58.93,33.27 | 55.63,48.26 C11.1 53.78,48.77 55.12,50.1 v55.12,53.59 | 30.8,40.64 33.78,40.64 | 33.78,40.64 32.77,41.66 32.77,49.02 31.75,50.04 v31.75,51.56 | v15.49,51.56 15.49,54.61 15.48,54.62 U$5.IN | 58.93,33.27 59.55,32.66 U1.61 69.8,32.66 C10.1 69.91,32.77 71.12,32.77 73.91,35.56 v73.91,36.58 | R10.2 v73.91,39.88 | 44.73,35.18 45.24,35.15 arc90 45.21,35.18 44.73,35.18 | v58.93,30.48 58.93,33.27 | v56.64,48.26 55.63,48.26 | v72.64,53.72 72.96,53.72 SUPPLY_SERVO.P$1
  Top 0.406: SUPPLY_SERVO.P$1 68.83,63.5 68.83,65.53 40.07,65.53 SUPPLY_THERMISTER.P$1 | U$5.IN 15.48,57.91 v16.26,57.91 16.26,57.47 C1.1 | R10.2 75.69,41.72 v75.69,41.66 | v93.47,41.66 91.44,41.66 R12.2 | v80.52,41.66 78.99,41.66 R8.2 80.77,41.72 v80.52,41.66 | v87.12,41.66 85.09,41.66 R14.2 87.12,41.72 v87.12,41.66
  Bottom 0.254: v20.83,15.24 SV2.1 | v32.51,34.29 v36.32,34.29
  Bottom 0.305: v93.47,41.66 v103.63,41.66 | v55.12,53.59 v49.78,53.59 | v31.75,51.56 v15.49,51.56 | v73.91,39.88 v73.91,36.58 | v56.13,30.48 v58.93,30.48 | v64.26,48.26 v56.64,48.26 | v66.29,53.72 v72.64,53.72
  Bottom 0.406: v75.69,41.66 v80.52,41.66 v87.12,41.66 v93.47,41.66
  Bottom 0.61: U$2.O 16.26,64.01 v16.26,57.91
VDD  (via drill 0.5, 0.6)
  Top 0.305: R9.2 80.01,32.26 76.2,32.26 | 76.2,32.26 76.2,37.15 | R23.2 R29.2 22.86,37.59 24.64,37.59 24.64,35.73 | R23.2 25.72,40.96 U$17.1 | R27.2 v24.89,32.7 24.89,30.73 | 24.89,30.73 25.72,30.73 U$19.1 | U$18.1 24.89,25.57 24.89,27.62 | R25.2 24.89,27.62 | U$20.1 24.64,35.73 | U$4.7 U$4.8 17.04,39.37 R22.2 | C3.1 24.89,59.37 v24.89,59.18 | 62.48,20.32 60.2,20.32 v60.2,14.22 | v72.14,14.22 73.66,14.22 R15.2 74.93,13.65 74.93,11.68 76.2,11.68 R16.2 | 92.71,49.46 91.19,49.46 | R4.2 76.2,53.34 77.22,54.36 81.53,54.36 v81.53,57.15 | U$4.7 16.76,34.29 | U$4.3 v8.89,33.02 | v19.81,34.29 U$4.7 | 24.89,27.62 v24.89,28.45 | v24.38,29.97 24.38,30.73 24.89,30.73 | v24.38,35.05 24.64,35.05 24.64,35.73 | R23.2 22.79,40.89 19.81,40.89 20.07,41.15 20.07,54.61 20.07,55.21 U$5.OUT | R20.1 62.48,20.32 | 62.48,20.32 62.48,23.88 63.5,24.89 71.63,24.89 76.2,29.46 76.2,32.26
  Top 0.406: U$7.1 76.2,37.15 | U$8.1 93.98,37.15 93.98,32 95.25,32 | U$9.1 88.9,37.15 88.9,32 | 88.9,32 90.17,32 R13.2 | R13.2 R7.2 85.09,32 83.82,32 | R13.2 90.68,32.07 90.68,31.75 | 90.68,31.75 90.17,31.75 R13.2 | U$6.1 83.06,37.15 83.06,32 83.82,32 | 90.68,31.75 95.25,31.75 R11.2 95.25,32 | R9.2 83.82,32.07 83.82,32 | U$21.1 42.42,53.51 42.42,55.63 40.64,55.63 | 40.64,55.63 R31.2 | 40.64,55.63 v40.64,57.4 | U$22.1 59.18,53.51 59.18,55.37 57.4,55.37 R33.2 v57.4,57.4 | R4.2 R3.2 R6.2 R5.2 92.71,49.46 94.55,49.46 | 94.55,49.46 R18.1 | 94.55,49.46 95,49.46 95,47.75 97.03,47.75 | 97.03,47.75 101.6,47.75 SV3.2 | 97.03,47.75 97.03,32 95.25,32 | C3.1 20.07,59.37 20.07,54.61 | C2.1 13.34,45.59 13.34,44.07 14.92,44.07 R22.2 | 88.9,32 87.94,32 C14.1 C13.1 88.01,26.92 88.01,25.02 83.9,25.02 U$1.14 U$1.13
  Bottom 0.254: v19.81,34.29 23.62,34.29 v24.38,35.05
  Bottom 0.305: v24.89,59.18 40.64,59.18 v40.64,57.4 | v60.2,14.22 v72.14,14.22 | v8.89,33.02 15.49,33.02 15.49,34.29 v19.81,34.29 | v24.89,28.45 24.38,28.45 v24.38,29.97 | v24.89,32.7 24.38,32.7 v24.38,35.05
  Bottom 0.406: v40.64,57.4 v57.4,57.4 57.4,57.15 v81.53,57.15
X_DIR
  Top 0.305: U1.25 43.91,27.66 41.91,25.65 41.91,12.89 U$27.P$1
X_ENABLE  (via drill 0.6)
  Top 0.305: U1.26 47.34,10.26 v47.24,10.16 | v39.12,10.16 39.12,4.64 U$28.P$1
  Bottom 0.305: v47.24,10.16 v39.12,10.16
X_PULSE
  Top 0.254: U1.24 45.68,28.16 45.72,28.19 46.74,28.19 47.24,27.69 45.21,25.65 45.21,10.41 50.04,5.59
  Top 0.305: 50.04,5.59 50.29,5.33 61.98,5.33 62.42,4.89 U$26.P$1
Y_DIR  (via drill 0.5)
  Top 0.254: 39.37,37.59 v37.59,39.37
  Top 0.305: U1.6 39.81,37.16 39.37,37.59
  Bottom 0.254: v37.59,39.37 6.16,39.37 U$30.P$1
Y_ENABLE  (via drill 0.5)
  Top 0.254: v38.86,36.32 40.89,36.32 41.15,36.58
  Top 0.305: U1.7 41.23,36.66 41.15,36.58
  Bottom 0.254: U$31.P$1 3.81,32.51 7.37,36.07 38.61,36.07 v38.86,36.32
Y_PULSE  (via drill 0.5)
  Top 0.254: v36.07,48.01 36.07,43.69 39.62,40.13
  Top 0.305: U1.5 42.1,37.66 39.62,40.13
  Bottom 0.254: U$29.P$1 35.62,48.45 v36.07,48.01

### Text on the board
tNames: GND | In | Temp | + | RX | TX | GND | Servo | + | GND | + | GND | G | Heater | - | SS | 5V | Pulse | 3.3V | s | Y-Axis | Dir | E | Jalebi 0.3 | Auger P | X-Enable | X-Dir | X-Pulse | Dir | Auger-Enable